# EAGLE design mff2-to-4ffnano-top v1.0 (EAGLE 9.6.2)
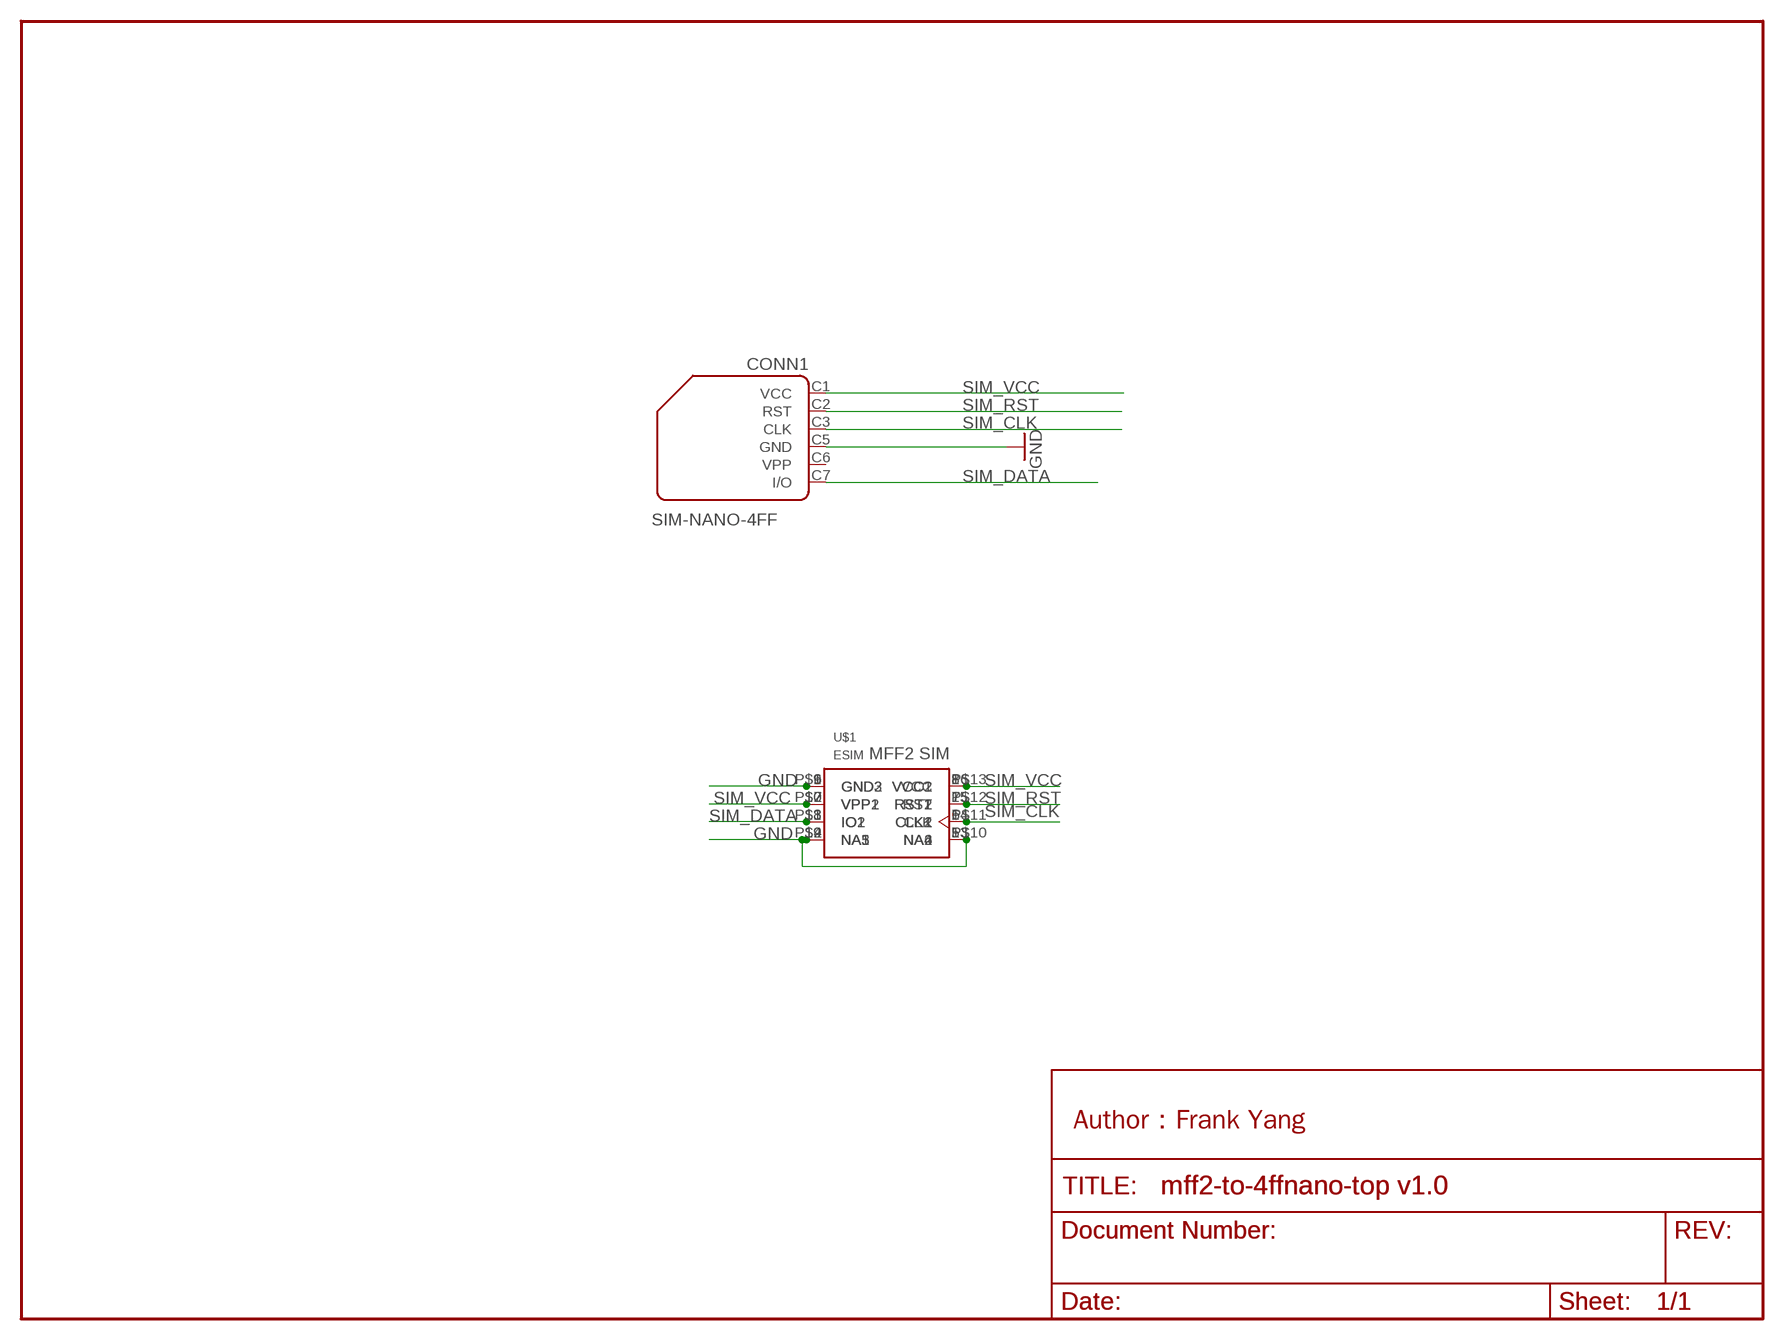
[diagram p0: schematic, sheet 1]

## Parts
CONN1  SIM-NANO-4FF  [GCT-SIM8100]
U$1  ESIM  [MFF2]

## Nets
GND: CONN1.C5(GND) U$1.1(GND) U$1.4(NA1) U$1.5(NA2) U$1.9(GND2) U$1.12(NA3) U$1.13(NA4) U$1.P$6(GND3) U$1.P$9(NA5) U$1.P$10(NA6)
SIM_CLK: CONN1.C3(CLK) U$1.6(CLK) U$1.14(CLK1) U$1.P$11(CLK2)
SIM_DATA: CONN1.C7(I/O) U$1.3(IO) U$1.11(IO1) U$1.P$8(IO2)
SIM_RST: CONN1.C2(RST) U$1.7(RST) U$1.15(RST1) U$1.P$12(RST2)
SIM_VCC: CONN1.C1(VCC) U$1.2(VPP) U$1.8(VCC) U$1.10(VPP1) U$1.16(VCC1) U$1.P$7(VPP2) U$1.P$13(VCC2)
Unconnected: CONN1.C6(VPP)

## Notes on the sheet
- MFF2 SIM
- Author：Frank Yang

## Library data of the parts
CONN1 = Particle:SIM-NANO-4FF: SIM NANO 4FF
U$1 = mff2-to-4ffnano:ESIM

## Net classes
1 DIFF_PAIR: width 0.203 mm, clearance 0.203 mm
2 RF: width 0.203 mm, clearance 0.257 mm
3 usb_lay3: width 0.152 mm, clearance 0.191 mm
4 3V3: width 0.305 mm, clearance 0.508 mm
5 USB_top: width 0.406 mm, drill 0.2 mm, clearance 0.152 mm
6 +3V3: width 0.203 mm, clearance 0.152 mm
7 PMID: width 0.305 mm, clearance 0.508 mm

## Board
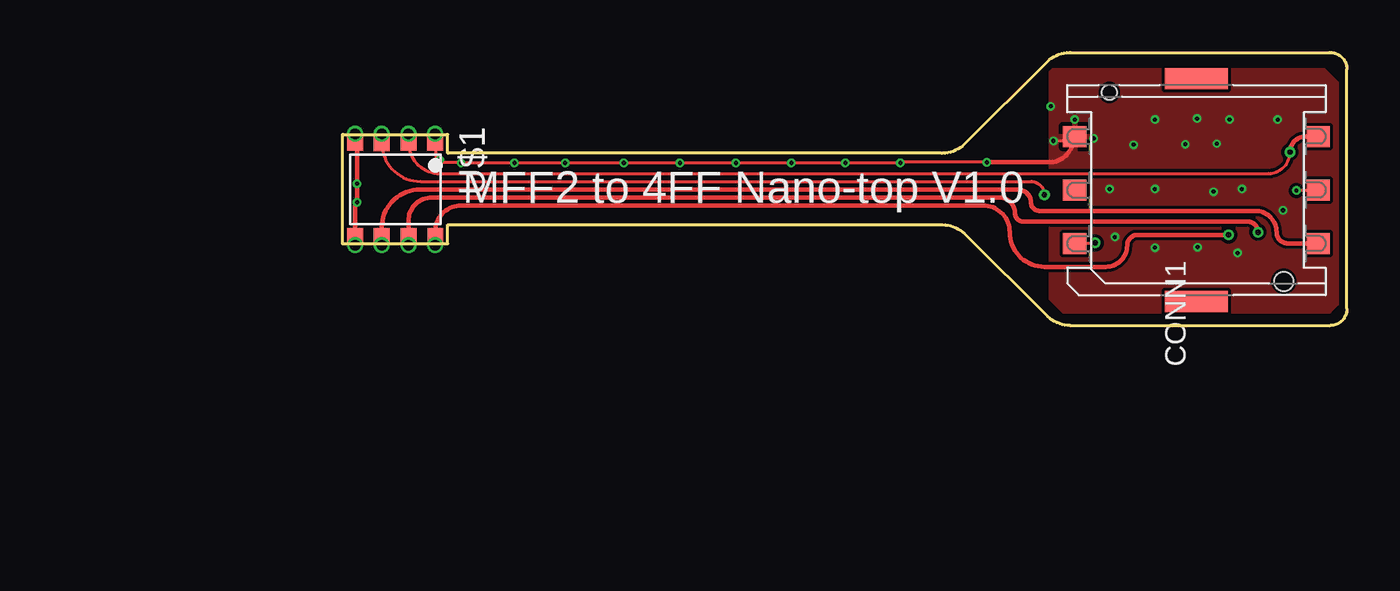
[diagram p1: board, top side]
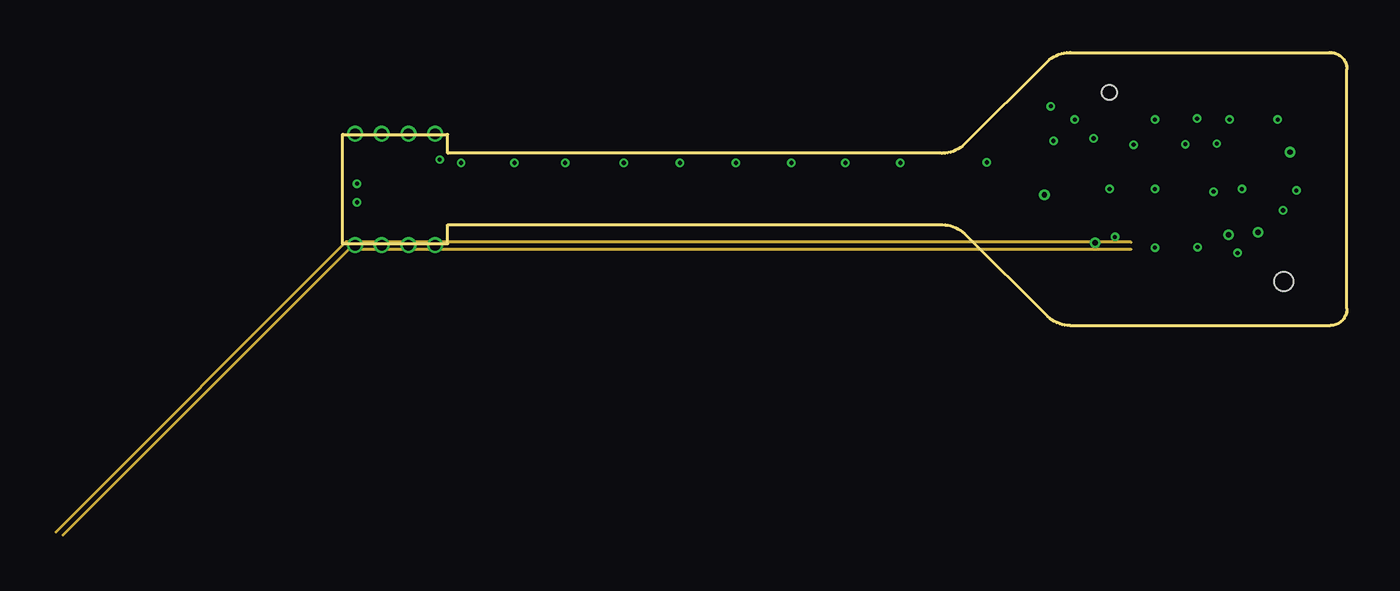
[diagram p2: board, inner layer L2-SIGNAL]
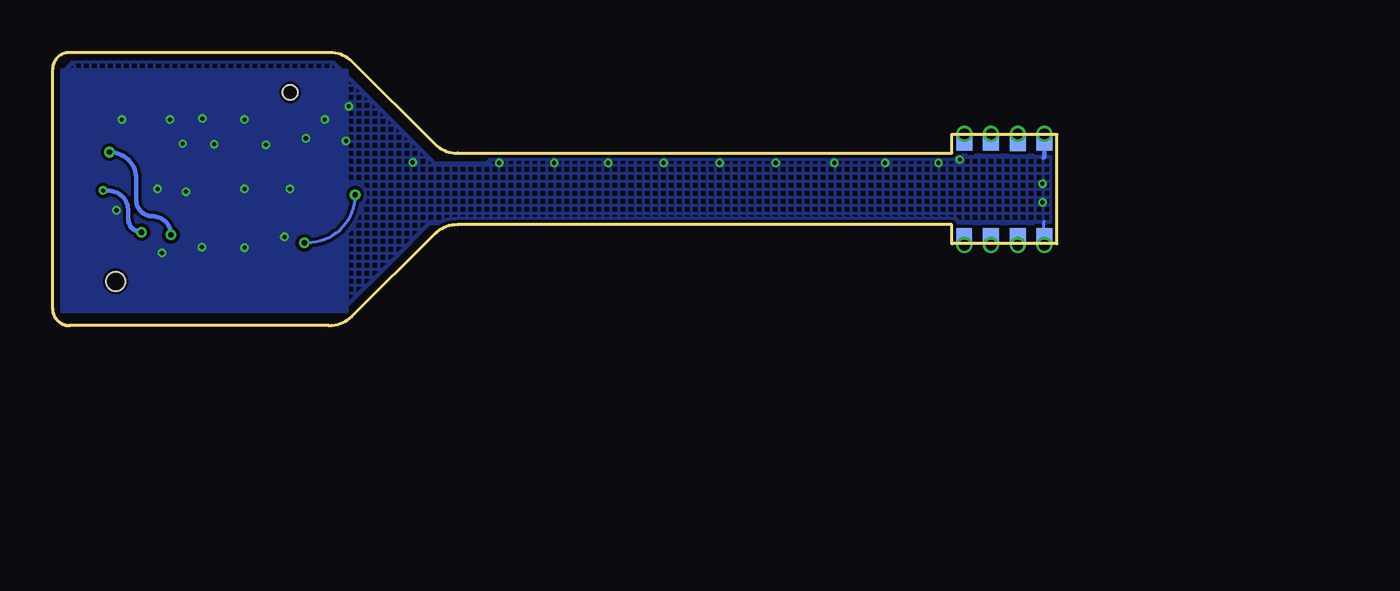
[diagram p3: board, bottom side, seen from below]

Size 47.8 x 13 mm. Coordinates in mm from the lower left corner, seen from the top.
Outline: 0,3.9 0,9.1 0.04,9.1 4.96,9.1 5,9.1 5,8.2 28.5,8.2 28.54,8.2 arc45 29.6,8.64 33.54,12.56 arc-45 34.6,13 34.64,13 46.96,13 47,13 arc-90 47.8,12.2 47.8,0.8 arc-90 47,0 46.96,0 34.66,0 34.62,0 arc-44 33.56,0.43 29.6,4.37 arc44 28.54,4.8 28.5,4.8 5,4.8 5,3.9 4.96,3.9 0.04,3.9 0,3.9
Copper layers (1*16): L1-TOP 0.035mm / dielectric 0.1mm / L6-BOTTOM 0.035mm
Design rules "particle-6layer *": minimum track width 4mil, minimum drill 0.1mm, track to track 6mil, track to pad 6mil, pad to pad 6mil, via to via 6mil, smd to smd 0mil, copper to edge 6mil, drill to drill 6mil, minimum pad ring 4mil, minimum via ring 4mil, stop-mask expansion 0mil, vias tented up to drill 20mil, thermal gap 8mil

### Footprints (pad centres in the part's own frame; a part is rotated, then mirrored left to right if it is on the bottom)
GCT-SIM8100 = smd 1 x 1.1: C1 2.54,-5.8; C2 0,-5.8; C3 -2.54,-5.8; C5 2.54,5.8; C6 0,5.8; C7 -2.54,5.8 | smd 1 x 3: NC@1 -5.3,0; NC@2 5.3,0 | hole 0.7: 4.65,4.15 | hole 0.9: -4.35,-4.15
MFF2 = smd 0.8 x 0.76 bottom: 1 -2.245,1.895; 2 -2.245,0.625; 3 -2.224,-0.645; 4 -2.245,-1.915; 5 2.245,-1.915; 6 2.245,-0.645; 7 2.245,0.625; 8 2.245,1.905 | smd 0.8 x 0.76: 9 -2.245,1.895; 10 -2.245,0.625; 11 -2.224,-0.645; 12 -2.245,-1.915; 13 2.245,-1.915; 14 2.245,-0.645; 15 2.245,0.625; 16 2.245,1.905 | drill 0.51 pad 0.76: P$6 -2.65,1.893; P$7 -2.65,0.623; P$8 -2.65,-0.647; P$9 -2.65,-1.917; P$10 2.65,-1.917; P$11 2.65,-0.647; P$12 2.65,0.623; P$13 2.65,1.893

### Placement (x,y rotation side)
CONN1  40.64,6.45 90 top
U$1  2.51,6.48 270 top

### Tracks (layer width: path | path; a pad name or v marks a point on that pad's centre or on a via)
GND  (via drill 0.2 pad 0.4)
  L1-TOP 0.152: CONN1.C5 34.77,8.92 34.64,8.79 v33.83,8.79 | v30.66,7.77 26.57,7.77 v26.54,7.75 v23.93,7.75 v21.36,7.75 v18.72,7.75 v16.05,7.75 v13.39,7.75 v10.59,7.75 v8.18,7.75 v5.64,7.75 arc90 5.61,7.77 4.83,7.77 arc-90 4.43,8.17 4.43,8.7 U$1.9
  L1-TOP 0.203: v30.66,7.77 33.62,7.77 arc90 34.77,8.92 | U$1.P$10 U$1.13 arc-90 U$1.13 0.6,5.78 arc-90 v0.69,5.87 v0.69,6.76 0.69,8.63 arc90 U$1.12 arc-90 U$1.12 U$1.P$9 | U$1.9 arc-90 U$1.9 U$1.P$6
  L6-BOTTOM 0.152: 0.62,4.23 0.62,4.96
  L6-BOTTOM 0.203: U$1.12 0.6,8.04 | 0.6,8.04 arc90 0.64,8 | 0.6,8.04 arc-90 0.59,8.04 U$1.P$9 | U$1.P$6 U$1.9 arc90 U$1.9 | U$1.13 U$1.P$10 arc-90 U$1.P$10
  other vias: 35.74,8.92 34.85,9.8 38.66,9.8 42.21,9.8 38.66,3.71 42.6,3.45 38.66,6.5 41.45,6.38 44.75,5.49 44.5,9.8 36.5,6.5 36.75,4.22 33.71,10.44 4.62,7.9 37.64,8.61 40.11,8.64 42.8,6.5 41.61,8.66 40.67,9.86 40.69,3.73
  pour L6-BOTTOM (rank 2, hatched): 0.1,8.03 0.1,4.85 0.13,4.83 29.85,4.83 31.62,3.05 34.04,0.63 47.37,0.63 47.37,12.06 47.24,12.19 46.86,12.57 43.05,12.57 34.42,12.57 32.77,10.92 29.59,7.75 27.18,7.75 26.8,8.13 0.25,8.13 0.13,8
  pour L1-TOP: 33.66,12.06 33.66,1.27 34.29,0.63 46.99,0.63 47.37,1.02 47.37,11.56 46.74,12.19 33.78,12.19
  pour L6-BOTTOM (no thermals): 33.78,12.19 33.78,0.63 35.18,0.63 47.37,0.63 47.37,0.76 47.37,12.19
MCU_USB_N
  L2-SIGNAL 0.152: 37.53,3.62 0.3,3.62 -13.31,-9.98
MCU_USB_P
  L2-SIGNAL 0.152: 37.53,3.96 0.15,3.96 -13.65,-9.84
SIM_CLK
  L1-TOP 0.152: CONN1.C3 46.36,3.91 45.42,3.91 45.39,3.89
  L1-TOP 0.203: 46.36,3.91 44.98,3.91 arc-90 44.45,4.45 arc90 43.43,5.46 33.15,5.46 arc-90 32.77,5.84 arc90 32.13,6.48 3.68,6.48 arc90 1.87,4.66 U$1.14 arc90 U$1.14 U$1.P$11
  L6-BOTTOM 0.203: U$1.14 U$1.P$11 arc-90 U$1.P$11
SIM_DATA  (via drill 0.25 pad 0.51)
  L1-TOP 0.152: U$1.11 arc90 3.71,6.86 32.77,6.86 arc-90 v33.4,6.22 | CONN1.C7 arc-90 34.86,3.94 v35.81,3.94
  L1-TOP 0.203: U$1.11 arc-90 U$1.11 U$1.P$8
  L6-BOTTOM 0.152: v33.4,6.22 arc90 35.69,3.94 v35.81,3.94
  L6-BOTTOM 0.203: U$1.P$8 U$1.11 arc90 U$1.11
SIM_RST  (via drill 0.2 pad 0.4, 0.25 pad 0.51)
  L1-TOP 0.152: CONN1.C2 46.42,6.43 v45.39,6.43
  L1-TOP 0.203: v43.56,4.45 arc90 43.05,4.95 32.39,4.95 arc-90 32,5.33 arc90 31.24,6.1 4.24,6.1 arc90 3.14,4.99 U$1.15 arc90 U$1.15 U$1.P$12
  L6-BOTTOM 0.203: v45.39,6.43 45.16,6.43 arc90 44.2,5.46 44.2,5.08 arc-90 v43.56,4.45 | U$1.15 U$1.P$12 arc-90 U$1.P$12
SIM_VCC  (via drill 0.25 pad 0.51)
  L1-TOP 0.152: U$1.10 arc90 4.62,7.24 44.07,7.24 arc90 v45.09,8.26
  L1-TOP 0.203: U$1.16 arc-90 4.42,4.49 | v42.16,4.32 37.85,4.32 arc90 37.34,3.81 arc-90 36.32,2.79 33.4,2.79 arc-90 31.75,4.45 arc90 30.48,5.71 5.64,5.71 arc90 4.42,4.49 | CONN1.C1 45.82,8.99 arc90 v45.09,8.26 | U$1.16 4.42,4.49 | U$1.16 arc90 4.4,4.22 U$1.P$13 | U$1.10 arc-90 U$1.10 U$1.P$7
  L6-BOTTOM 0.203: v45.09,8.26 arc90 43.81,6.98 43.81,5.97 arc-90 43.05,5.21 arc90 v42.16,4.32 | U$1.P$7 U$1.10 arc90 U$1.10 | U$1.16 4.42,3.84 arc-90 U$1.P$13

### Text on the board
tPlace: MFF2 to 4FF Nano-top V1.0
Document: 36层，加补强板